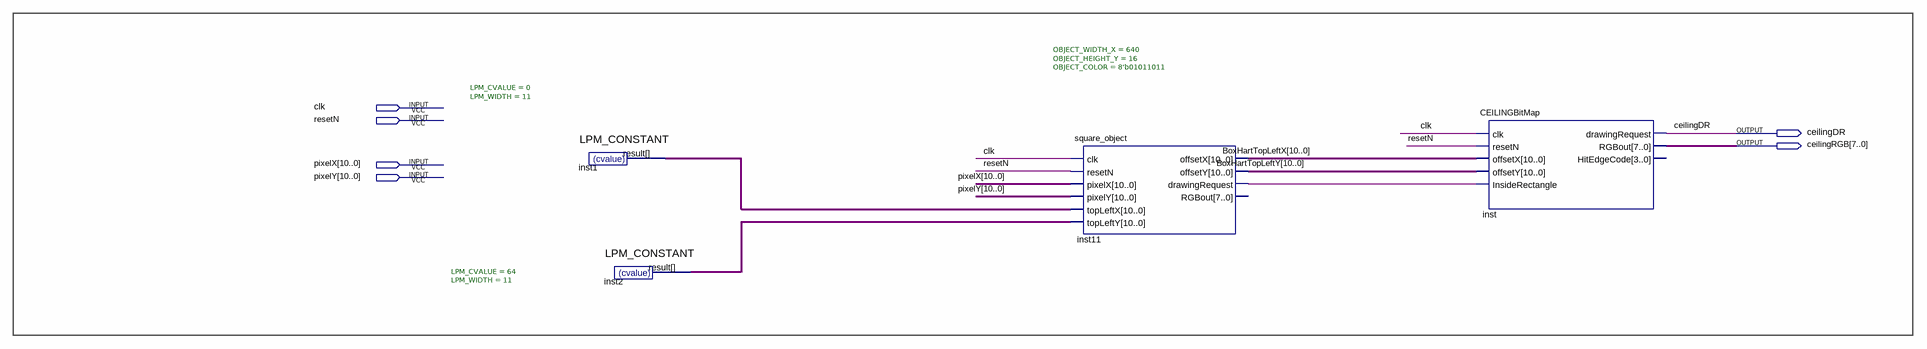
[diagram p0: schematic sheet]
// Quartus schematic CEILING_DISPLAY.bdf as structural Verilog: 4 symbols, 6 pins
module CEILING_DISPLAY (
  input  clk,
  input  resetN,
  input  [10:0] pixelX,
  input  [10:0] pixelY,
  output ceilingDR,
  output [7:0] ceilingRGB
);

  wire inst11_drawingrequest;
  wire [10:0] BoxHartTopLeftX, BoxHartTopLeftY, inst1_result, inst2_result;

  LPM_CONSTANT #(.LPM_CVALUE(0), .LPM_WIDTH(11)) inst1 (.result(inst1_result));
  LPM_CONSTANT #(.LPM_CVALUE(64), .LPM_WIDTH(11)) inst2 (.result(inst2_result));
  square_object #(.OBJECT_WIDTH_X(640), .OBJECT_HEIGHT_Y(16), .OBJECT_COLOR(8'b01011011)) inst11 (
    .clk(clk), .resetN(resetN), .pixelX(pixelX), .pixelY(pixelY), .topLeftX(inst1_result),
    .topLeftY(inst2_result), .offsetX(BoxHartTopLeftX), .offsetY(BoxHartTopLeftY),
    .drawingRequest(inst11_drawingrequest));  // open: RGBout
  CEILINGBitMap inst (
    .clk(clk), .resetN(resetN), .offsetX(BoxHartTopLeftX), .offsetY(BoxHartTopLeftY),
    .InsideRectangle(inst11_drawingrequest), .drawingRequest(ceilingDR), .RGBout(ceilingRGB));  // open: HitEdgeCode
endmodule
